# Altium project Battery_Level_Indicator.PrjPcb
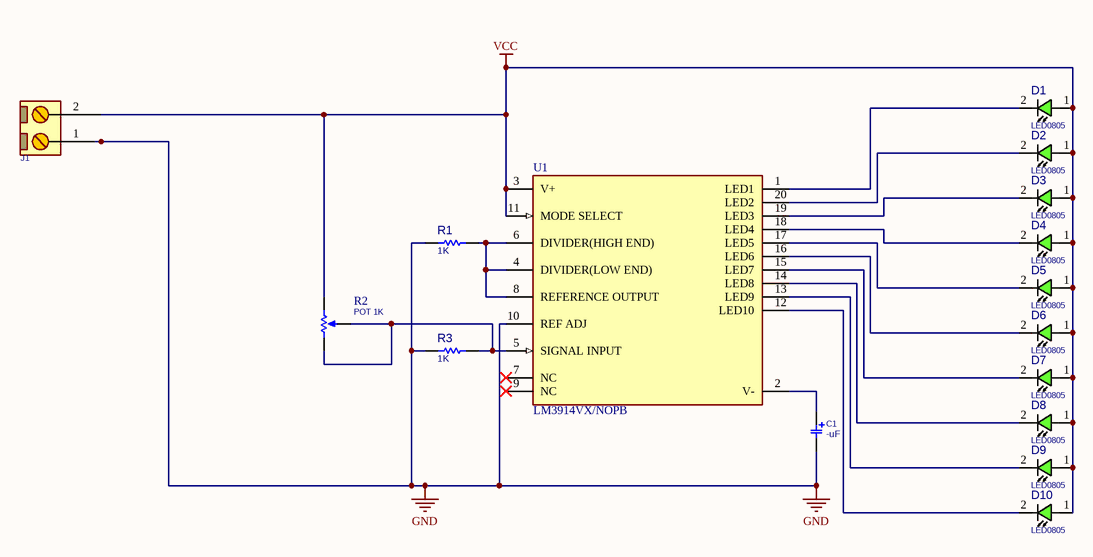
[diagram p0: Sheet1.SchDoc]
1 sheet, 16 parts. Net scope: global (net labels, ports and power ports of the same name join across sheets).
Board files: PCB1.PcbDoc, PCB2_Panel.PcbDoc

## Sheet Sheet1.SchDoc
size A4; SheetNumber: 1; SheetTotal: 1

### Parts
C1  -uF  [C_TN_3216]
D1  LED0805  [LED0805]
D2  LED0805  [LED0805]
D3  LED0805  [LED0805]
D4  LED0805  [LED0805]
D5  LED0805  [LED0805]
D6  LED0805  [LED0805]
D7  LED0805  [LED0805]
D8  LED0805  [LED0805]
D9  LED0805  [LED0805]
D10  LED0805  [LED0805]
J1  CONN_TB2  [TBB_2]  (value not drawn)
R1  1K  [R0805]
R2  POT 1K  [POTS_3314G]
R3  1K  [R0805]
U1  LM3914VX/NOPB  [FP-FN0020A-IPC_B]

### Nets
GND: C1.2 J1.1 R1.1 R3.1 U1.10(REF_ADJ)
VCC: D1.1(ANODE) D2.1(ANODE) D3.1(ANODE) D4.1(ANODE) D5.1(ANODE) D6.1(ANODE) D7.1(ANODE) D8.1(ANODE) D9.1(ANODE) D10.1(ANODE) J1.2 R2.3(BOT) U1.3(V+) U1.11(MODE_SELECT)
NetC1_1: C1.1 U1.2(V-)
NetD1_2: D1.2(CATHODE) U1.1(LED1)
NetD2_2: D2.2(CATHODE) U1.20(LED2)
NetD3_2: D3.2(CATHODE) U1.19(LED3)
NetD4_2: D4.2(CATHODE) U1.18(LED4)
NetD5_2: D5.2(CATHODE) U1.17(LED5)
NetD6_2: D6.2(CATHODE) U1.16(LED6)
NetD7_2: D7.2(CATHODE) U1.15(LED7)
NetD8_2: D8.2(CATHODE) U1.14(LED8)
NetD9_2: D9.2(CATHODE) U1.13(LED9)
NetD10_2: D10.2(CATHODE) U1.12(LED10)
NetR1_2: R1.2 U1.4(DIVIDER(LOW_END)) U1.6(DIVIDER(HIGH_END)) U1.8(REFERENCE_OUTPUT)
NetR2_1: R2.1(TOP) R2.2(TAP) R3.2 U1.5(SIGNAL_INPUT)

Not connected (* = marked no-connect by the designer): U1 7(NC)* 9(NC)*

### Library data of the parts
C1 = CAP_SMD_TAN_3216: CAP, SMD, TAN,; PARAM2: -V; VALUE: -uF
D1-D10 = LED_SMD_0805: LED, SMD, 0805; DESC: DESCRIPTION; MANF_P#: MANF_PART#; PARAM2: 2.2V; MANF: MANF; ASSEMBLY: ASSEMBLY; PRICE: PRICE; VALUE: LED0805
J1 = CONN_TB2: CONN, TERMINAL BLOCK, 5.08mm pitch; VALUE: CONN_TB2
R1 R3 = RES_SMD_0805: RESISTOR, SMD; PARAM: -W; DESC: DESCRIPTION; DIST#: MOUSER; PARAM2: 1%; MANF_P#: -; MANF: -; ASSEMBLY: ASSEMBLY; PRICE: 100= 0.5$; VALUE: 1K
R2 = RES_SMD_POT_3314G: RESISTOR, SMD, Potentiometer; VALUE: POT 1K
U1 = CMP-04914-000012-1: IC DRVR DOT/BAR DISPLAY 20PLCC; Manufacturer: Texas Instruments; Standoff Height: 0.51mm; Min Supply Voltage: 3V; Output Current: 10mA; Number Of Outputs: 10; Output Voltage: 1.28V; Max Supply Voltage: 15V; Automotive: No; Temperature: 0°C to +70°C; Device Class L2: Power Management ICs; Ipc Land Pattern Name: PLCC127P990X990X457-20; Octopart: https://octopart.com/lm3914vx%2Fnopb-texas+instruments-24814204; Height: 4.57mm; Package: FN0020A; Mouser Description: LED Lighting Drivers DOT/BAR DISPLAY DRVR; Temperature Range Low: 0°C; Category: IC; ComponentLink2URL: http://www.ti.com/lit/ds/symlink/lm3914.pdf; Digikey Description: IC DRVR DOT/BAR DISPLAY 20PLCC; Lead Free: Yes; Device Class L1: Integrated Circuits (ICs); RoHS: TRUE; Temperature Range High: +70°C; Device Class L3: LED Drivers; Manufacturer Part Number: LM3914VX/NOPB; ComponentLink2Description: Datasheet